# Altium schematic sheet Mobile Tracker Hat.SchDoc: Mobile Tracker Hat
size B; Engineer: JChiu; Organization: ToyBuilder Labs; Address1: 2736 E Walnut St; Address2: Pasadena, California 91107; Address4: +1 (626) 808-4010; DocumentNumber: 2; SheetNumber: 2; SheetTotal: 2
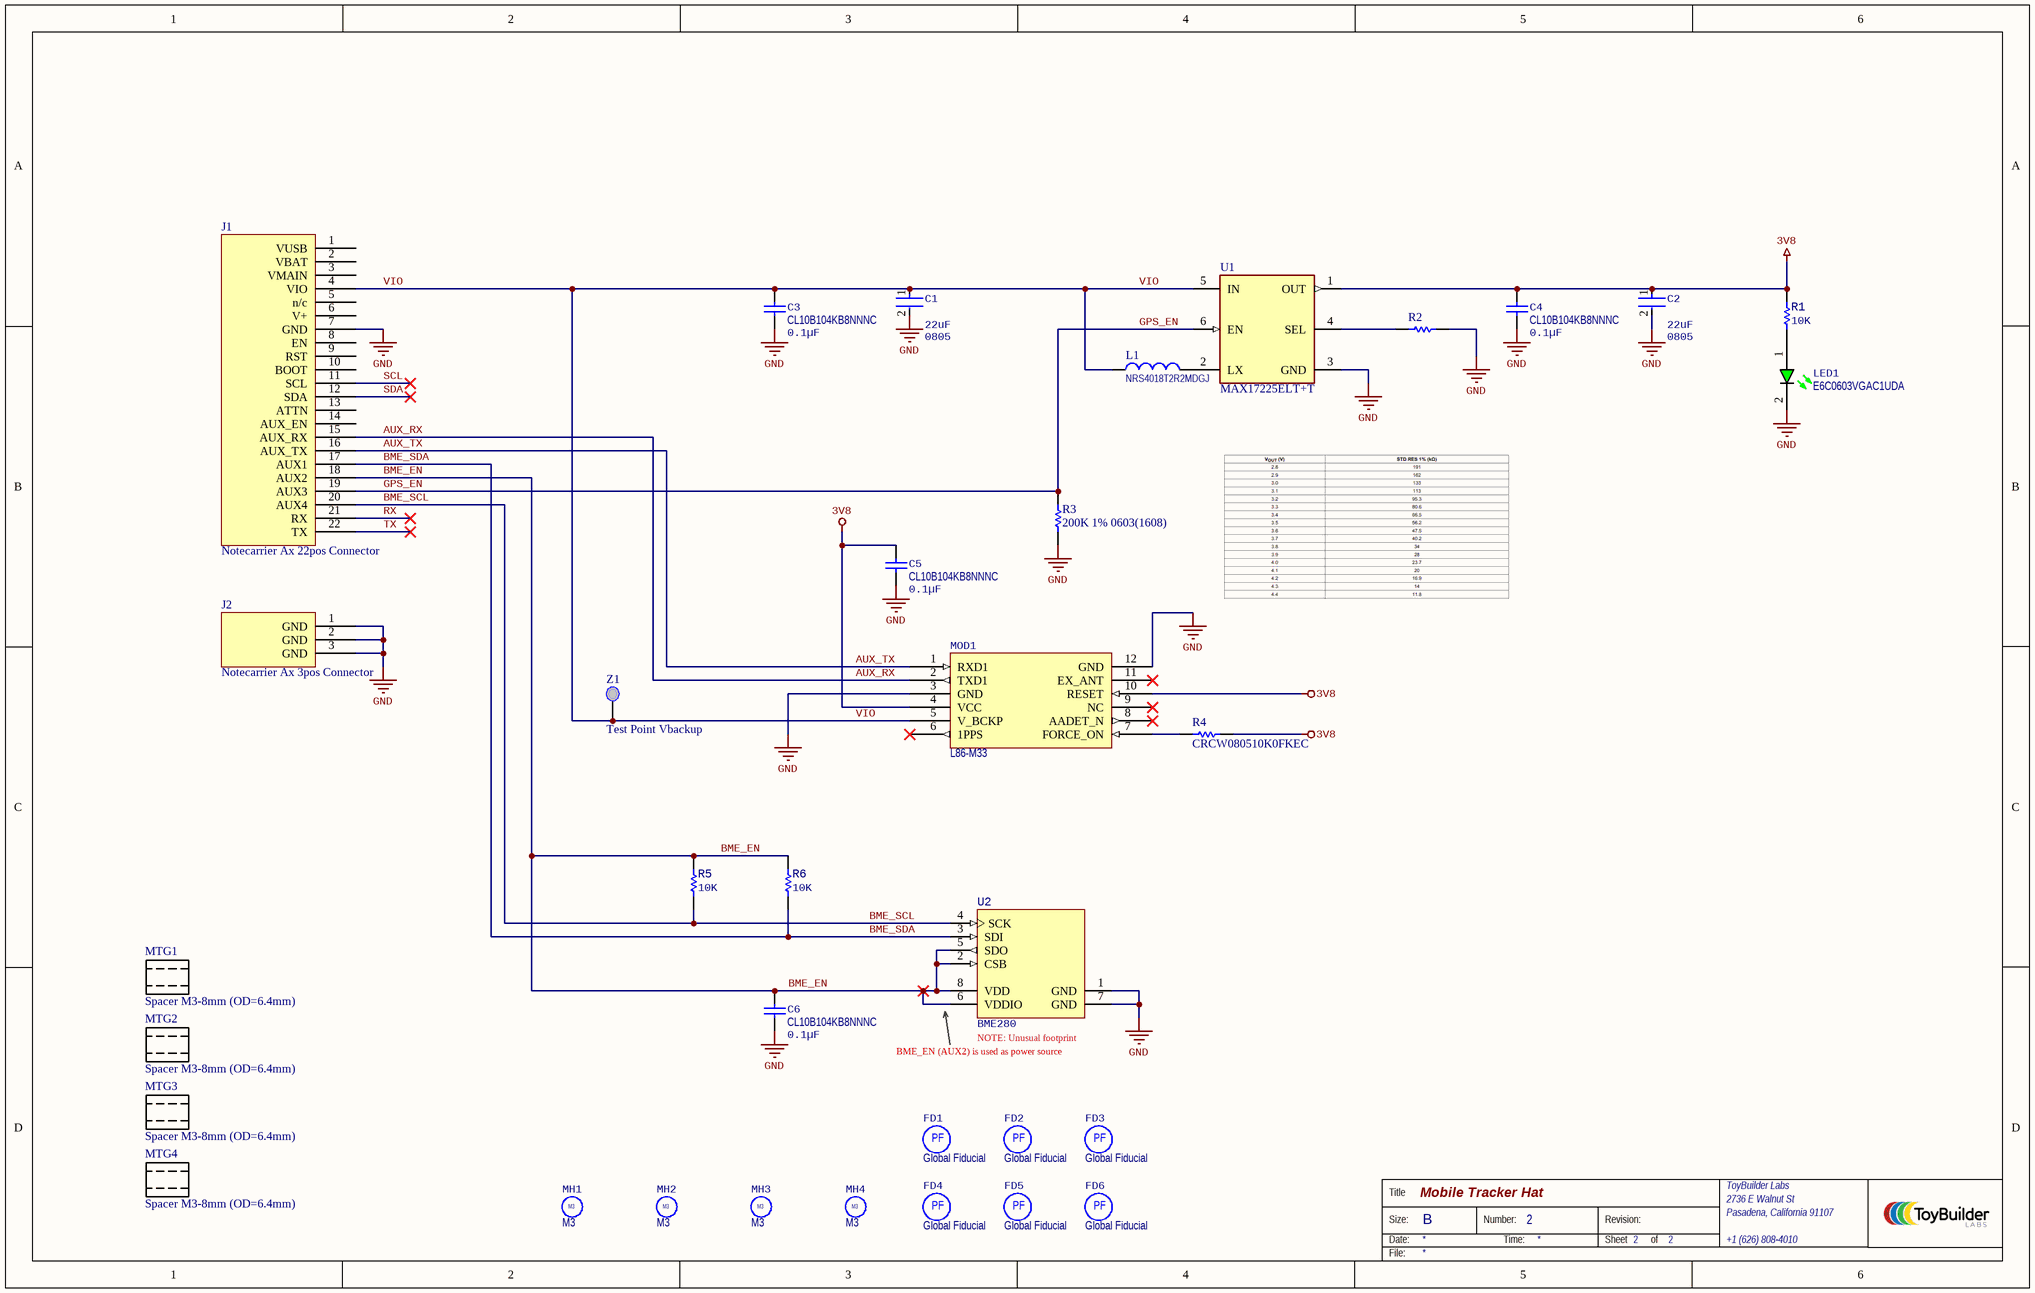
[diagram p0: Mobile Tracker Hat.SchDoc]

## Parts
C1  Capacitance: 22uF  Case Code (Imperial): 0805  [FP-CL21-IPC_A]  (hidden comment: CL21A226MQQNNNE)
C2  Capacitance: 22uF  Case Code (Imperial): 0805  [FP-CL21-IPC_A]  (hidden comment: CL21A226MQQNNNE)
C3  CL10B104KB8NNNC  Capacitance: 0.1µF  [SAMS-C0603-2_M]
C4  CL10B104KB8NNNC  Capacitance: 0.1µF  [SAMS-C0603-2_M]
C5  CL10B104KB8NNNC  Capacitance: 0.1µF  [SAMS-C0603-2_M]
C6  CL10B104KB8NNNC  Capacitance: 0.1µF  [SAMS-C0603-2_M]
FD1  Global Fiducial  [FID_1mm_3mm]  (no BOM)
FD2  Global Fiducial  [FID_1mm_3mm]  (no BOM)
FD3  Global Fiducial  [FID_1mm_3mm]  (no BOM)
FD4  Global Fiducial  [FID_1mm_3mm]  (no BOM)
FD5  Global Fiducial  [FID_1mm_3mm]  (no BOM)
FD6  Global Fiducial  [FID_1mm_3mm]  (no BOM)
J1  Notecarrier Ax 22pos Connector  [HDR-NC-AX-22_4UCON]
J2  Notecarrier Ax 3pos Connector  [HDR-NC-AX-3_4UCON]
L1  NRS4018T2R2MDGJ  [COIL_4040x18]
LED1  E6C0603VGAC1UDA  [E6C0603VGAC1UDA]
MH1  M3  [HOLE_3MM]  (no BOM)
MH2  M3  [HOLE_3MM]  (no BOM)
MH3  M3  [HOLE_3MM]  (no BOM)
MH4  M3  [HOLE_3MM]  (no BOM)
MOD1  L86-M33  [Quectel L86]
MTG1  Spacer M3-8mm (OD=6.4mm)  [SPACER_M3_8MM (4.75 OD)]
MTG2  Spacer M3-8mm (OD=6.4mm)  [SPACER_M3_8MM (4.75 OD)]
MTG3  Spacer M3-8mm (OD=6.4mm)  [SPACER_M3_8MM (4.75 OD)]
MTG4  Spacer M3-8mm (OD=6.4mm)  [SPACER_M3_8MM (4.75 OD)]
R1  value 10K  [RESC0603(1608)_N]  (hidden comment: 10K 5% 0603(1608))
R2  CRCW060334K0FKEA  [RESC1609X50X30ML10T20]  (value not drawn)
R3  200K 1% 0603(1608)  [RESC0603(1608)_L]
R4  CRCW080510K0FKEC  [RESC2013X50X30NL20T20]
R5  value 10K  [RESC0603(1608)_N]  (hidden comment: 10K 5% 0603(1608))
R6  value 10K  [RESC0603(1608)_N]  (hidden comment: 10K 5% 0603(1608))
U1  MAX17225ELT+T  [FP-L622-1C-MFG]
U2  BME280  [BOSC-BME280-8_V]
Z1  Test Point Vbackup  [testp_40pad]  (no BOM)

## Nets
3V8: C2.1 C4.2 C5.2 MOD1.4(VCC) MOD1.10(RESET) R1.2 R4.2 U1.1(OUT)
GND: C1.2 C2.2 C3.1 C4.1 C5.1 C6.1 J1.7(GND) J2.1(GND) J2.2(GND) J2.3(GND) LED1.2(K) MOD1.3(GND) MOD1.12(GND) R2.2 R3.1 U1.3(GND) U2.1(GND) U2.7(GND)
AUX_RX: J1.15(AUX_RX) MOD1.2(TXD1)
AUX_TX: J1.16(AUX_TX) MOD1.1(RXD1)
BME_EN: C6.2 J1.18(AUX2) R5.2 R6.2 U2.2(CSB) U2.5(SDO) U2.6(VDDIO) U2.8(VDD)
BME_SCL: J1.20(AUX4) R5.1 U2.4(SCK)
BME_SDA: J1.17(AUX1) R6.1 U2.3(SDI)
GPS_EN: J1.19(AUX3) R3.2 U1.6(EN)
RX: J1.21(RX)
SCL: J1.11(SCL)
SDA: J1.12(SDA)
TX: J1.22(TX)
VIO: C1.1 C3.2 J1.4(VIO) L1.1 MOD1.5(V_BCKP) U1.5(IN) Z1.1
NetL1_2: L1.2 U1.2(LX)
NetLED1_1: LED1.1(A) R1.1
NetMOD1_7: MOD1.7(FORCE_ON) R4.1
NetR2_1: R2.1 U1.4(SEL)

Not connected (* = marked no-connect by the designer): J1 1(VUSB) 2(VBAT) 3(VMAIN) 5(n/c) 6(V+) 8(EN) 9(RST) 10(BOOT) 13(ATTN) 14(AUX_EN); MOD1 6(1PPS)* 8(AADET_N)* 9(NC)* 11(EX_ANT)*

## Notes on the sheet
- (near U2) NOTE: Unusual footprint
- (near U2) BME_EN (AUX2) is used as power source
- Title
- Size:
- Date:
- B
- Number:
- Time:
- Revision:
- Sheet
- of
- File:
- (in symbol Fiducial_Global) PF

## Library data of the parts
C1 C2 = CMP-13271-000185-1: CL21 Series 0805 22uF 6.3V ±20% Tolerance X5R Multilayer Ceramic Chip Capacitor; Manufacturer 1: Samsung; Height: 1.25mm; Length: 2mm; Mount: Surface Mount; Dielectric: X5R; Voltage Rating (DC): 6.3V; Case Code (Metric): 2012; Depth: 1.25mm; Max Operating Temperature: 85°C; Voltage Rating: 6.3V; Width: 0.049inch; Case/Package: 0805; Radiation Hardening: No; Thickness: 0.055inch; Packaging: Tape and Reel; Package Quantity: 2000; Lead Free: Lead Free; Contact Plating: Tin; Min Operating Temperature: -55°C; Tolerance: 20%; Supplier 1: Digi-Key; Supplier Part Number 1: 1276-1100-1-ND; Manufacturer Part Number 1: CL21A226MQQNNNE; RoHS: Yes; Category: Ceramic Capacitors; Stock 1: 1173708; Pricing 1: 1=0.15000, 10=0.10900, 50=0.06180, 100=0.05120, 500=0.03592, 1000=0.02973 (USD); Series: CL; RoHS Compliant: Yes; ComponentLink1URL: https://datasheet.ciiva.com/25796/cl21a226mqqnnne-25796195.pdf?src-supplier=Digi-Key; ComponentLink1Description: https://datasheet.ciiva.com/25796/cl21a226mqqnnne-25796195.pdf?src-supplier=Digi-Key; ComponentLink2URL: https://datasheet.ciiva.com/26838/getdatasheetpartid-357607-26838611.pdf?src-supplier=Verical; ComponentLink2Description: https://datasheet.ciiva.com/26838/getdatasheetpartid-357607-26838611.pdf?src-supplier=Verical; ComponentLink3URL: https://datasheet.ciiva.com/16361/cl21a226mqqnnne-16361189.pdf?src-supplier=Future+Electronics; ComponentLink3Description: https://datasheet.ciiva.com/16361/cl21a226mqqnnne-16361189.pdf?src-supplier=Future+Electronics; ComponentLink4URL: https://datasheet.ciiva.com/26787/cl21a226mqqnnne-26787006.pdf?src-supplier=IIIC; ComponentLink4Description: https://datasheet.ciiva.com/26787/cl21a226mqqnnne-26787006.pdf?src-supplier=IIIC
C3-C6 = CMP-2000-05332-1: Multi-layer Ceramic Capacitor, -55 to 125 degC, 2-Pin SMD (0603), RoHS, Tape and Reel; Manufacturer: Samsung Electro-Mechanics; Manufacturer 1: Samsung; Rated Voltage: 50V; Dielectric: X7R; Tolerance (%): ±10%; Tolerance: 10%; Case Size/Dimension: 0603; Datasheet URL: https://datasheet.ciiva.com/29198/456651-da-01-en-vs-kondensator-0605-29198839.pdf; Manufacturer URL: http://www.samsungsem.com/global/index.jsp; Datasheet Version: Nov-10; Supplier 1: Digi-Key; Supplier Part Number 1: 1276-1000-1-ND; Manufacturer Part Number 1: CL10B104KB8NNNC; RoHS: Yes; Category: Ceramic Capacitors; Stock 1: 16478375; Pricing 1: 1=0.10000, 10=0.03000, 50=0.01620, 100=0.01330, 500=0.00950, 1000=0.00746 (USD); Mount: Surface Mount; Case/Package: 0603; Case Code (Metric): 1608; Case Code (Imperial): 0603; Contact Plating: Tin; Material: Ceramic; Min Operating Temperature: -55°C; Max Operating Temperature: 125°C; Voltage Rating: 50V; Package Quantity: 1; Packaging: Tape and Reel; Series: CL; Voltage: 50V; Voltage Rating (DC): 50V; Construction: Flat; Length: 1.6mm; Width: 0.031inch; Height: 0.8mm; Thickness: 0.035inch; Depth: 0.8mm; Radiation Hardening: No; RoHS Compliant: Yes; Lead Free: Lead Free; ComponentLink1URL: https://datasheet.ciiva.com/25803/cl10b104kb8nnnc-25803393.pdf?src-supplier=Digi-Key; ComponentLink1Description: https://datasheet.ciiva.com/25803/cl10b104kb8nnnc-25803393.pdf?src-supplier=Digi-Key; ComponentLink2URL: https://datasheet.ciiva.com/26838/getdatasheetpartid-89097-26838411.pdf?src-supplier=Verical; ComponentLink2Description: https://datasheet.ciiva.com/26838/getdatasheetpartid-89097-26838411.pdf?src-supplier=Verical; ComponentLink3URL: https://datasheet.ciiva.com/29198/456651-da-01-en-vs-kondensator-0605-29198839.pdf?src-supplier=Conrad; ComponentLink3Description: https://datasheet.ciiva.com/29198/456651-da-01-en-vs-kondensator-0605-29198839.pdf?src-supplier=Conrad
FD1-FD6 = Fiducial_Global: Fiducial, Global
J1 = HDR-NC-AX-22_4UCON: Header, 22 pos. For connection to Notecarrier Ax.; Manufacturer: 4UCON; Manufacturer Part Number: 22042; Connector Type: Male Pin; Function 1: Function 1; Function 2: Function 2; Category: Connectors; Height: 2.5mm; ComponentLink1URL: http://www.4uconnector.com/online/object/4udrawing/22042.pdf; ComponentLink1Description: Datasheet; Supplier 1: 4UCON; Supplier Part Number 1: 22042
J2 = HDR-NC-AX-3_4UCON: Header, 3 pos. For connection to Notecarrier Ax.; Manufacturer: 4UCON; Manufacturer Part Number: 00626; Connector Type: Male Pin; Function 1: Function 1; Function 2: Function 2; Supplier 1: 4UCON; Category: Connectors; Height: 2.5mm; ComponentLink1URL: http://www.4uconnector.com/online/object/4udrawing/00626.pdf; ComponentLink1Description: Supplier Page; Supplier Part Number 1: 00626
L1 = TAIYO_NRS4018T2R2MDGJ: 2.2uH, 2.20A, SMD (4.0 x 4.0mm, 1.8 mm high); Manufacturer: Taiyo Yuden; Core Material: Ferrite; Self Resonant Frequency: 60MHz; Tolerance: 20%; DC Resistance (DCR): 42mR; Max DC Current: 3A; Current Rating: 2.2A; Shielding: Shielded; Test Frequency: 100kHz; Supplier 1: Digi-Key; Supplier Part Number 1: 587-2890-1-ND; Manufacturer Part Number: NRS4018T2R2MDGJ; RoHS: Yes; Category: Fixed Inductors; Stock 1: 4650; Pricing 1: 1=0.29000, 10=0.26100, 100=0.17930, 500=0.15324, 1000=0.11738 (USD); Mount: Surface Mount; Case/Package: Nonstandard; Number of Pins: 2; Min Operating Temperature: -25°C; Max Operating Temperature: 125°C; Inductance: 2.2uH; Packaging: Cut Tape; Package Quantity: 3500; Saturation Current: 3A; Composition: Wirewound; Termination: SMD/SMT; Inductance Tolerance: 20%; RMS Current (Irms): 2.2A; Length: 4mm; Height: 1.8mm; Width: 0.157inch; Height - Seated (Max): 0.071inch; Depth: 4.2mm; Lead Pitch: 2.8mm; Radiation Hardening: No; Halogen Free: Halogen Free; Lead Free: Lead Free; REACH SVHC: Unknown; ComponentLink1URL: https://datasheet.ciiva.com/7291/nrs4018t2r2mdgj-ss-7291680.pdf?src-supplier=Newark; ComponentLink1Description: https://datasheet.ciiva.com/7291/nrs4018t2r2mdgj-ss-7291680.pdf?src-supplier=Newark; ComponentLink2URL: https://datasheet.ciiva.com/8502/nrs4018t2r2mdgj-ss-8502646.pdf?src-supplier=Avnet; ComponentLink2Description: https://datasheet.ciiva.com/8502/nrs4018t2r2mdgj-ss-8502646.pdf?src-supplier=Avnet; ComponentLink3URL: https://datasheet.ciiva.com/25607/0900766b810b3cd2-25607949.pdf?src-supplier=RSComponents; ComponentLink3Description: https://datasheet.ciiva.com/25607/0900766b810b3cd2-25607949.pdf?src-supplier=RSComponents
LED1 = E6C0603VGAC1UDA: Green 520nm 800mcd @ 20mA, 1.6 x 0.8 mm; Manufacturer: EKINGLUX; Lens Color: Colorless; Lens Transparency: Clear; Lens Style: Rectangle with Flat Top; Lens Size: 1.10mm x 0.60mm; Voltage - Forward (Vf) (Typ): 3.0V; Viewing Angle: 120°; Supplier 1: LCSC; Manufacturer Part Number: E6C0603VGAC1UDA; Category: Optoelectronics; Packaging: Cut Tape (CT); Color: Green; Millicandela Rating: 800mcd; Current - Test: 20mA; Mounting Type: Surface Mount; Wavelength - Dominant: 520nm; Wavelength - Peak: 520nm; Package / Case: 0603 (1608 Metric); Supplier Device Package: Chip LED; Height (Max): 0.60mm; ComponentLink1URL: https://datasheet.lcsc.com/szlcsc/1912111437_EKINGLUX-E6C0603VGAC1UDA_C375447.pdf; ComponentLink1Description: https://datasheet.lcsc.com/szlcsc/1912111437_EKINGLUX-E6C0603VGAC1UDA_C375447.pdf; Supplier Part Number 1: C375447
MH1-MH4 = Bare Hole M3: Bare Hole, M3
MOD1 = L86-M33: Global Navigation Satellite System Module with Patch Antenna. Quectel L86-M33; Manufacturer 1: Quectel Wireless Solutions; Supplier 1: Digi-Key; Manufacturer Part Number 1: L86-M33; RoHS: Yes; Category: Connectors; Pricing 1: 1=12.70000, 10=11.49500, 25=10.58760, 100=9.68000 (USD); ComponentLink1URL: http://www.quectel.com/UploadFile/Product/Quectel_L86_GNSS_Specification_V1.0.pdf?src-supplier=Avnet; ComponentLink1Description: http://www.quectel.com/UploadFile/Product/Quectel_L86_GNSS_Specification_V1.0.pdf?src-supplier=Avnet; Supplier Part Number 1: 2958-L86-M33CT-ND
MTG1-MTG4 = SPACER_M3_8MM (6.40 OD): Spacer, non-threaded. M3 ID, 6.4mm OD.  L=8mm
R1 R5 R6 = CMP-1012-00098-1: 10K 0.1W 5% 0603 (1608 Metric)  SMD; Case-EIA: 0603; Case-Metric: 1608; Technology: SMT; Tolerance: 5 %; Power: 0.1 W
R2 = CMP-00015-2: Res SMD 0603 34K Ohm 1% 1/10W
R3 = CMP-00002-1: 200K 0.1W 1% 0603 (1608 Metric)  SMD; Value: 200000.00 Ohm; Case-EIA: 0603; Case-Metric: 1608; Tolerance: 1 %; Technology: SMT; Power: 0.1 W
R4 = CMP-00014-2: Res SMD 0805 10K Ohm 1% 1/8W
U1 = CMP-00003-2: Switching Voltage Regulators 0.9V to 5V, 500mA Input Current Limit Ultra Low Pow; ComponentLink2Description: Datasheet; ComponentLink2URL: https://datasheets.maximintegrated.com/en/ds/MAX17220-MAX17225.pdf; Mount: Surface Mount; RoHS Compliant: Yes; Number of Pins: 6; Packaging: Tape and Reel
U2 = CMP-2000-05073-1: Combined Humidity and Pressure Sensor, 1.71 to 3.6 V, -40 to 85 degC, 8-Pin SMD, RoHS, Tape and Reel; Manufacturer: Bosch Sensortec; Description 1: Pressure, Temperature and Humidity Sensor Digital Output 1.8V 8-Pin LGA T/R; Sensor Type: Temperature; Output Type: SPI,I2C; Accuracy: 3%; Response Time: 1s; Datasheet Version: Rev. 1.2, 10/2015; Datasheet URL: http://datasheet.octopart.com/BME280-Bosch-datasheet-58577763.pdf; Manufacturer URL: http://www.bosch-sensortec.com; Supplier 1: Digi-Key; Supplier Part Number 1: 828-1063-1-ND; Manufacturer Part Number: BME280; RoHS: No; Category: Pressure Sensors; Stock 1: 47722; Pricing 1: 1=6.55000, 5=5.77600, 10=5.10100, 25=4.13880, 50=3.65760, 100=3.56130, 500=2.98376, 1000=2.79125, 5000=2.59875 (USD); Mount: Surface Mount; Case/Package: LGA; Number of Pins: 8; Min Operating Temperature: -40°C; Max Operating Temperature: 85°C; Packaging: Cut Tape; Lead Free: Lead Free; ComponentLink1URL: https://ae-bst.resource.bosch.com/media/_tech/media/datasheets/BST-BME280-DS002.pdf?src-supplier=Digi-Key; ComponentLink1Description: https://ae-bst.resource.bosch.com/media/_tech/media/datasheets/BST-BME280-DS002.pdf?src-supplier=Digi-Key; ComponentLink2URL: https://ae-bst.resource.bosch.com/media/_tech/media/product_flyer/BME280_Productflyer_BST_20170109.pdf?src-supplier=Mouser; ComponentLink2Description: https://ae-bst.resource.bosch.com/media/_tech/media/product_flyer/BME280_Productflyer_BST_20170109.pdf?src-supplier=Mouser; ComponentLink3URL: https://ae-bst.resource.bosch.com/media/_tech/media/product_flyer/BME280_Productflyer_BST_20170109.pdf?src-supplier=Arrow+Electronics; ComponentLink3Description: https://ae-bst.resource.bosch.com/media/_tech/media/product_flyer/BME280_Productflyer_BST_20170109.pdf?src-supplier=Arrow+Electronics; ComponentLink4URL: https://ae-bst.resource.bosch.com/media/_tech/media/product_flyer/BME280_Productflyer_BST_20170109.pdf?src-supplier=NAC+Semi; ComponentLink4Description: https://ae-bst.resource.bosch.com/media/_tech/media/product_flyer/BME280_Productflyer_BST_20170109.pdf?src-supplier=NAC+Semi
Z1 = test_pt: Test point